# Altium schematic sheet Sheet1.SchDoc
size A; SheetNumber: 1; SheetTotal: 1
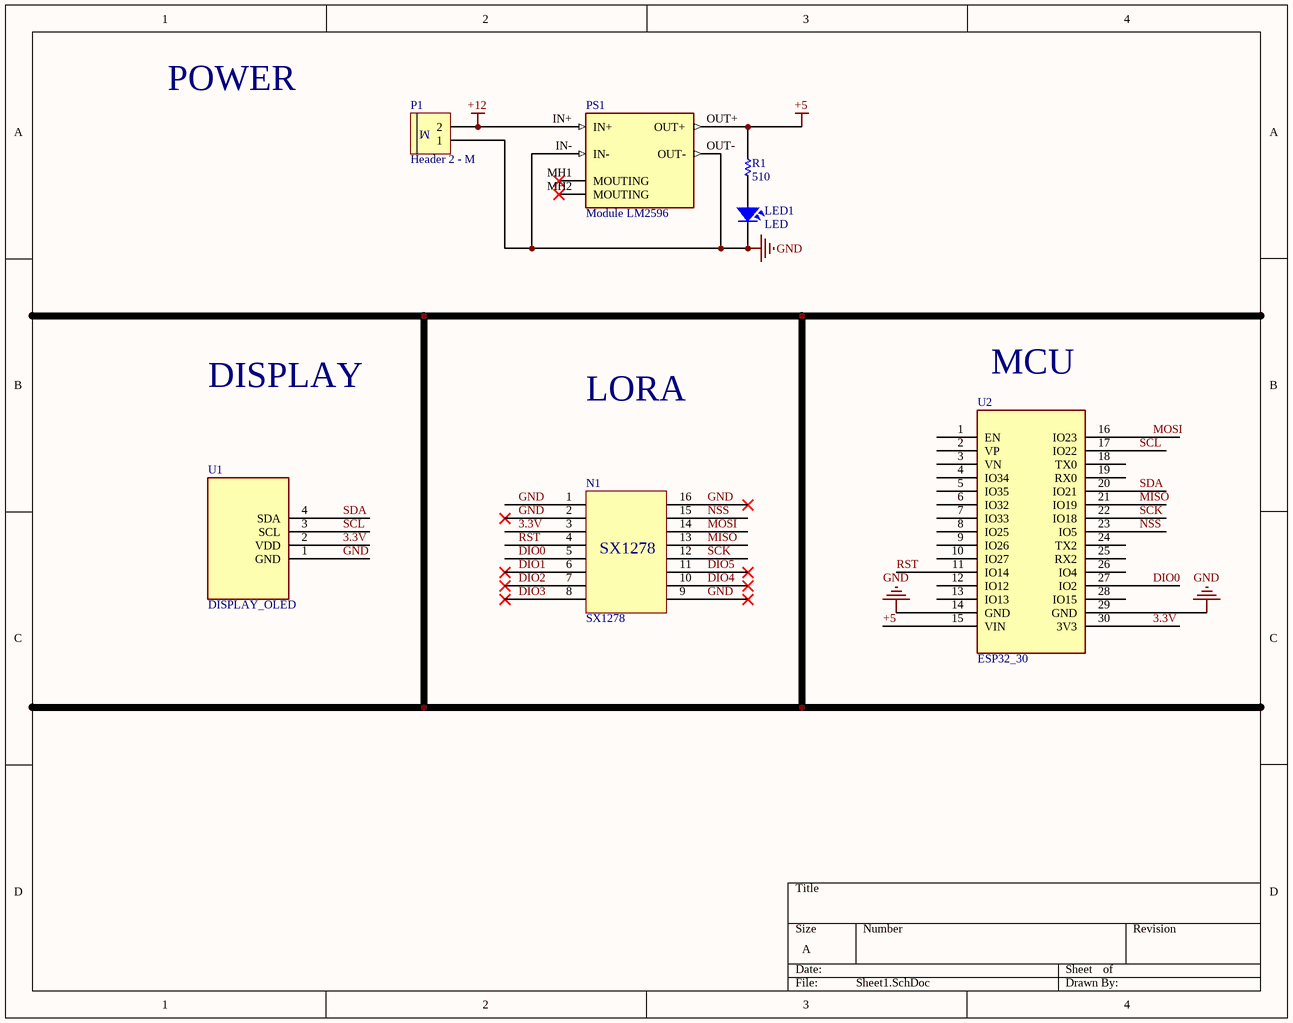
[diagram p0: Sheet1.SchDoc]

## Parts
LED1  LED  [LED-3]
N1  SX1278  [DIP16]
P1  Header 2 - M  [Medium - Header 2]
PS1  Module LM2596  [CONV_MC00100]
R1  510  [RES-1/2W]
U1  DISPLAY_OLED  [DISPLAY_OLED]
U2  ESP32_30  [ESP32_30]

## Nets
+5: PS1.OUT+ R1.1 U2.15(VIN)
+12: P1.2 PS1.IN+
\: LED1.2 N1.1 N1.2 N1.9 N1.16 P1.1 PS1.IN- PS1.OUT- U1.1(GND) U2.14(GND) U2.29(GND)  [also labelled GND]
3.3V: N1.3 U1.2(VDD) U2.30(3V3)
DIO0: N1.5 U2.27(IO2)
DIO1: N1.6
DIO2: N1.7
DIO3: N1.8
DIO4: N1.10
DIO5: N1.11
MISO: N1.13 U2.21(IO19)
MOSI: N1.14 U2.16(IO23)
NSS: N1.15 U2.23(IO5)
RST: N1.4 U2.11(IO14)
SCK: N1.12 U2.22(IO18)
SCL: U1.3(SCL) U2.17(IO22)
SDA: U1.4(SDA) U2.20(IO21)
NetLED1_1: LED1.1 R1.2

Not connected (* = marked no-connect by the designer): PS1 MH1(MOUTING)* MH2(MOUTING)*; U2 1(EN) 2(VP) 3(VN) 4(IO34) 5(IO35) 6(IO32) 7(IO33) 8(IO25) 9(IO26) 10(IO27) 12(IO12) 13(IO13) 18(TX0) 19(RX0) 24(TX2) 25(RX2) 26(IO4) 28(IO15)

## Notes on the sheet
- POWER
- DISPLAY
- LORA
- MCU
- (in symbol Header 2 - M) M

## Library data of the parts
LED1 = LED: LED Single colour Green and Red; Value: LED 3 ly Single Colour
P1 = Header 2 - M: Header, 2-Pin, Medium; LatestRevisionDate: 17-Jul-2002; LatestRevisionNote: Re-released for DXP Platform.; Publisher: Altium Limited
PS1 = MC00100: DC-DC LM2596 Step Down Adjustable Converter Power Supply Module 1.3V-35V; MF: YKS; SnapEDA_Link: https://www.snapeda.com/parts/MC00100/YKS/view-part/?ref=snap; Package: None; Value: *; MP: MC00100; Check_prices: https://www.snapeda.com/parts/MC00100/YKS/view-part/?ref=eda
R1 = Res: Manufacturer: Generic Components; Class: Passive; SubClass: R; Published: 08/06/2000; Publisher: Altium Hobart Technology Centre
U1 = DISPLAY_OLED: Display Oled 128x64 0.96" I2C.
U2 = ESP32_30: Microcontoller Board 30 Pins Wifi 2.4GHz BLE 4.2 ESP32-WROOM-32D; ComponentLink1Description: Datasheet; ComponentLink1URL: https://www.mouser.com/datasheet/2/891/esp32_wroom_32d_esp32_wroom_32u_datasheet_en-1365844.pdf